# EAGLE design SchematicStepperV3 (EAGLE 7.7.0)
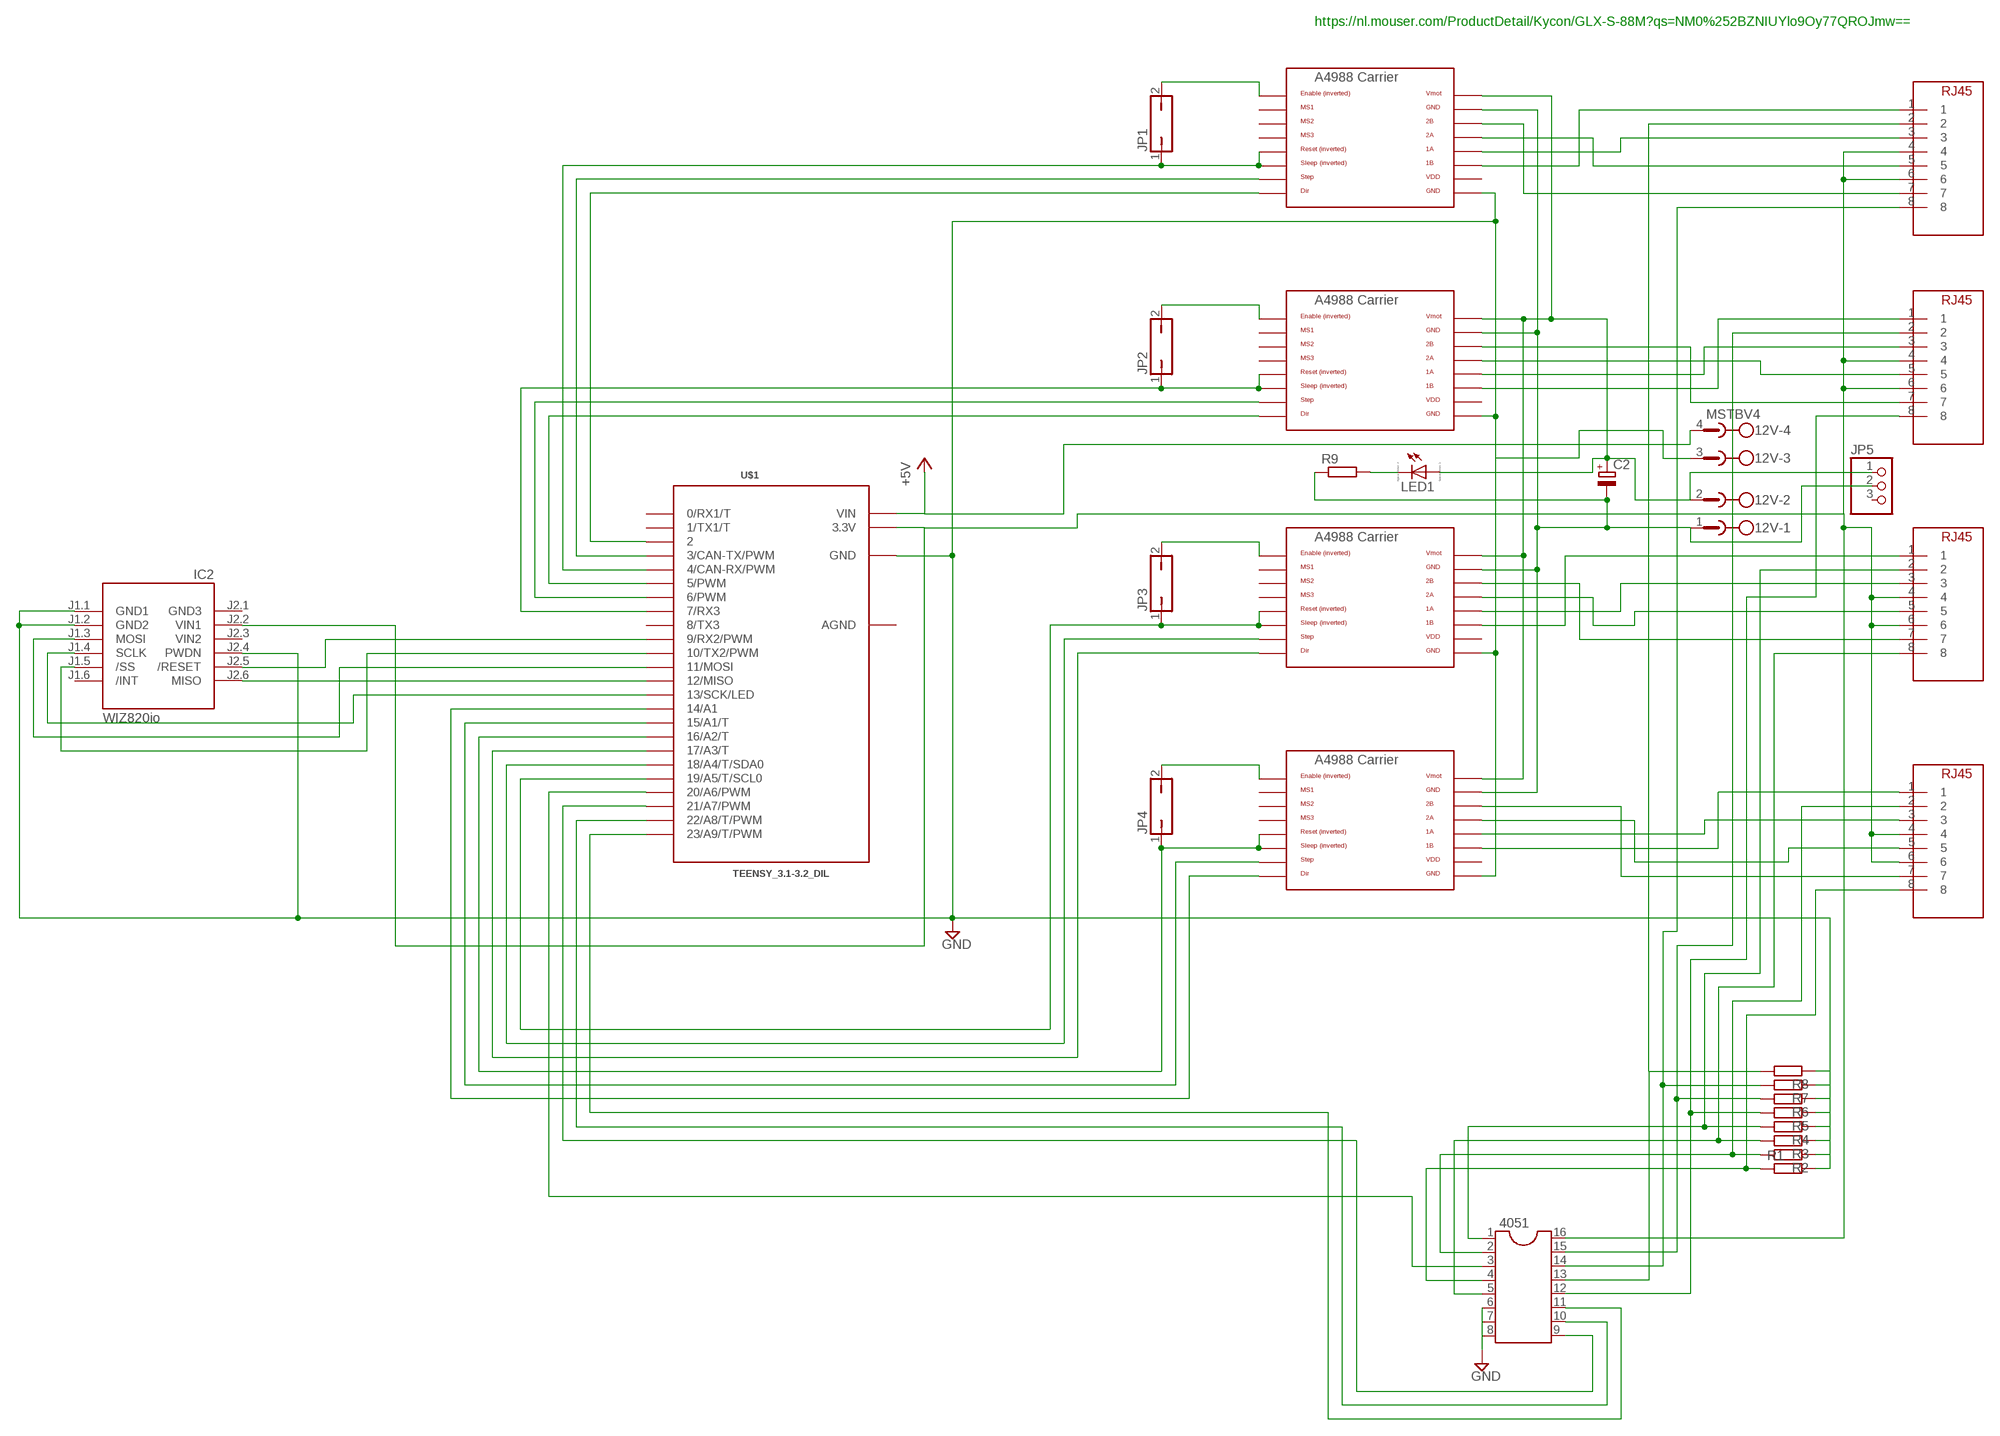
[diagram p0: schematic, sheet 1]

## Parts
12V  MSTBV4  [MSTBV4]
4051  DIL16  [DIL16]
C2  CPOL-EUB45181B  [B45181B]
IC2  WIZ820io  WIZ820IO_DEVICE'DUAL-IN-LINE'  [WIZ820IO]
JP1  JP1Q  [JP1]
JP2  JP1Q  [JP1]
JP3  JP1Q  [JP1]
JP4  JP1Q  [JP1]
JP5  PINHD-1X3  [1X03]
LED1  LED_ELD260  [LED_LD260]
R1  R-EU_0309/10  [0309/10]
R2  R-EU_0309/10  [0309/10]
R3  R-EU_0309/10  [0309/10]
R4  R-EU_0309/10  [0309/10]
R5  R-EU_0309/10  [0309/10]
R6  R-EU_0309/10  [0309/10]
R7  R-EU_0309/10  [0309/10]
R8  R-EU_0309/10  [0309/10]
R9  R-EU_0309/10  [0309/10]
U$1  TEENSY_3.1-3.2_DIL  [TEENSY_3.0-3.2&LC_DIL]
U$2  A4988BREAKOUT  [A4988BREAKOUT]
U$3  A4988BREAKOUT  [A4988BREAKOUT]
U$4  A4988BREAKOUT  [A4988BREAKOUT]
U$5  A4988BREAKOUT  [A4988BREAKOUT]
WEIDMUELLER_RJ1  WEIDMUELLER_RJ45  [WEIDMUELLER_RJ45]
WEIDMUELLER_RJ2  WEIDMUELLER_RJ45  [WEIDMUELLER_RJ45]
WEIDMUELLER_RJ3  WEIDMUELLER_RJ45  [WEIDMUELLER_RJ45]
WEIDMUELLER_RJ4  WEIDMUELLER_RJ45  [WEIDMUELLER_RJ45]

## Nets
4051: 4051.3 U$1.20/A6(20/A6/PWM)
+5V: 12V.4 U$1.VIN
GND: 12V.3 4051.6 4051.7 4051.8 IC2.J1.1(GND1) IC2.J1.2(GND2) IC2.J2.4(PWDN) R1.2 R2.1 R3.1 R4.1 R5.1 R6.1 R7.1 R8.1 U$1.GND U$2.GND U$3.GND U$4.GND U$5.GND
N$1: JP2.1 U$1.7(7/RX3) U$3.RST U$3.SLP(SLEEP)
N$2: 12V.1 C2.- JP5.2 R9.1 U$2.GND_MOT U$3.GND_MOT U$4.GND_MOT U$5.GND_MOT
N$3: JP3.1 U$1.19/A5(19/A5/T/SCL0) U$4.RST U$4.SLP(SLEEP)
N$4: JP1.1 U$1.4(4/CAN-RX/PWM) U$2.RST U$2.SLP(SLEEP)
N$5: U$1.2 U$2.DIR
N$6: U$1.3(3/CAN-TX/PWM) U$2.STEP
N$7: U$1.5(5/PWM) U$3.DIR
N$8: U$1.6(6/PWM) U$3.STEP
N$11: U$1.17/A3(17/A3/T) U$4.DIR
N$12: U$1.18/A4(18/A4/T/SDA0) U$4.STEP
N$13: 12V.2 C2.+ JP5.1 LED1.A U$2.VMOT U$3.VMOT U$4.VMOT U$5.VMOT
N$14: JP4.1 U$1.16/A2(16/A2/T) U$5.RST U$5.SLP(SLEEP)
N$15: U$3.1A WEIDMUELLER_RJ2.3
N$16: U$2.2B WEIDMUELLER_RJ1.7
N$17: U$2.1A WEIDMUELLER_RJ1.3
N$18: 4051.16 IC2.J2.2(VIN1) U$1.3.3V WEIDMUELLER_RJ1.4 WEIDMUELLER_RJ1.6 WEIDMUELLER_RJ2.4 WEIDMUELLER_RJ2.6 WEIDMUELLER_RJ3.4 WEIDMUELLER_RJ3.6 WEIDMUELLER_RJ4.4 WEIDMUELLER_RJ4.6
N$19: IC2.J2.5(/RESET) U$1.9(9/RX2/PWM)
N$20: IC2.J2.6(MISO) U$1.12(12/MISO)
N$21: IC2.J1.3(MOSI) U$1.11(11/MOSI)
N$22: IC2.J1.4(SCLK) U$1.13(13/SCK/LED)
N$23: IC2.J1.5(/SS) U$1.10(10/TX2/PWM)
N$24: U$2.2A WEIDMUELLER_RJ1.5
N$25: U$3.2A WEIDMUELLER_RJ2.5
N$26: U$3.2B WEIDMUELLER_RJ2.7
N$27: U$4.2A WEIDMUELLER_RJ3.5
N$28: U$3.1B WEIDMUELLER_RJ2.1
N$29: U$4.1A WEIDMUELLER_RJ3.3
N$30: U$4.2B WEIDMUELLER_RJ3.7
N$31: U$5.1A WEIDMUELLER_RJ4.3
N$32: U$4.1B WEIDMUELLER_RJ3.1
N$33: U$5.2B WEIDMUELLER_RJ4.7
N$34: U$5.2A WEIDMUELLER_RJ4.5
N$35: U$5.1B WEIDMUELLER_RJ4.1
N$36: LED1.K(C) R9.2
N$37: JP1.2 U$2.EN
N$38: JP2.2 U$3.EN
N$39: JP3.2 U$4.EN
N$40: JP4.2 U$5.EN
N$41: 4051.9 U$1.21/A7(21/A7/PWM)
N$42: 4051.13 R8.2 WEIDMUELLER_RJ1.2
N$43: 4051.10 U$1.22/A8(22/A8/T/PWM)
N$44: 4051.11 U$1.23/A9(23/A9/T/PWM)
N$45: 4051.14 R7.2 WEIDMUELLER_RJ1.8
N$46: 4051.15 R6.2 WEIDMUELLER_RJ2.2
N$47: 4051.12 R5.2 WEIDMUELLER_RJ2.8
N$48: 4051.1 R4.2 WEIDMUELLER_RJ3.2
N$49: 4051.5 R3.2 WEIDMUELLER_RJ3.8
N$50: 4051.2 R2.2 WEIDMUELLER_RJ4.2
N$51: 4051.4 R1.1 WEIDMUELLER_RJ4.8
N$52: U$2.1B WEIDMUELLER_RJ1.1
N$56: U$1.15/A1(15/A1/T) U$5.STEP
N$57: U$1.14/A0(14/A1) U$5.DIR
Unconnected: IC2.J1.6(/INT) JP5.3 U$1.0(0/RX1/T) U$1.1(1/TX1/T) U$1.8(8/TX3) U$2.MS1 U$2.MS2 U$2.MS3 U$3.MS1 U$3.MS2 U$3.MS3 U$4.MS1 U$4.MS2 U$4.MS3 U$5.MS1 U$5.MS2 U$5.MS3

## Notes on the sheet
- https://nl.mouser.com/ProductDetail/Kycon/GLX-S-88M?qs=NM0%252BZNIUYlo9Oy77QROJmw==

## Power pins joined to a net without a drawn wire
AGND: U$1.AGND
GND3: IC2.J2.1(GND3)
VDD: U$2.VDD U$3.VDD U$4.VDD U$5.VDD
VIN2: IC2.J2.3(VIN2)

## Library data of the parts
12V = con-phoenix-508:MSTBV4: PHOENIX; MPN: MSTBV 2,5/4-GF-5.08; OC_FARNELL: 1792794; OC_NEWARK: 69R9847
4051 = ic-package:DIL16: Dual In Line / Socket
C2 = rcl:CPOL-EU: POLARIZED CAPACITOR, European symbol
IC2 = Wiz820io:WIZ820IO_DEVICE: WIZnet, WIZ820io plug in module incl. W5200 chip and MagJack
JP1-JP4 = jumper:JP1Q: JUMPER
JP5 = adafruit:PINHD-1X3: PIN HEADER
LED1 = eagle-ltspice:LED_E: LED Source: http://www.osram.convergy.de Source: www.luxeon.com Source: www.kingbright.com; SPICEMODEL: NONE; SPICEPREFIX: D; SPICETYPE: diode
R1-R9 = rcl:R-EU_: RESISTOR, European symbol
U$1 = Teensy_3_and_LC_Series_Boards_v1.4:TEENSY_3.1-3.2_DIL: Teensy 3.1 or 3.2 in a DIL Layout.
U$2-U$5 = RepRapjr:A4988BREAKOUT
WEIDMUELLER_RJ1-WEIDMUELLER_RJ4 = Weidmueller_RJ45_CAT6 T1U 2.7N4N:WEIDMUELLER_RJ45

## Board
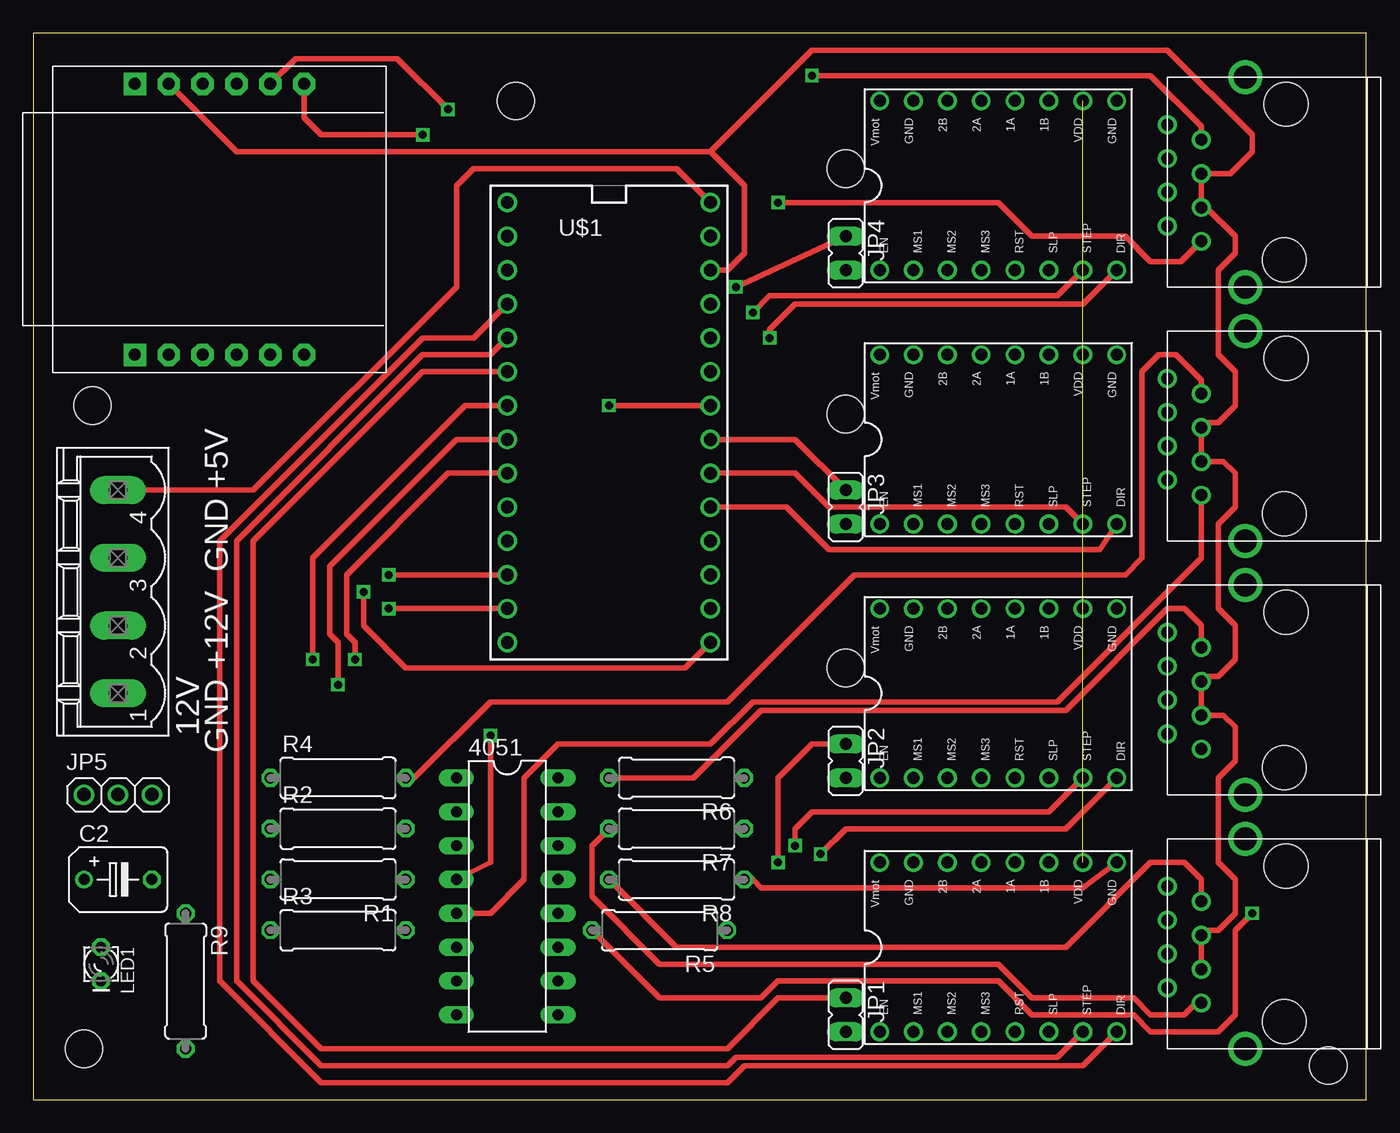
[diagram p1: board, top side]
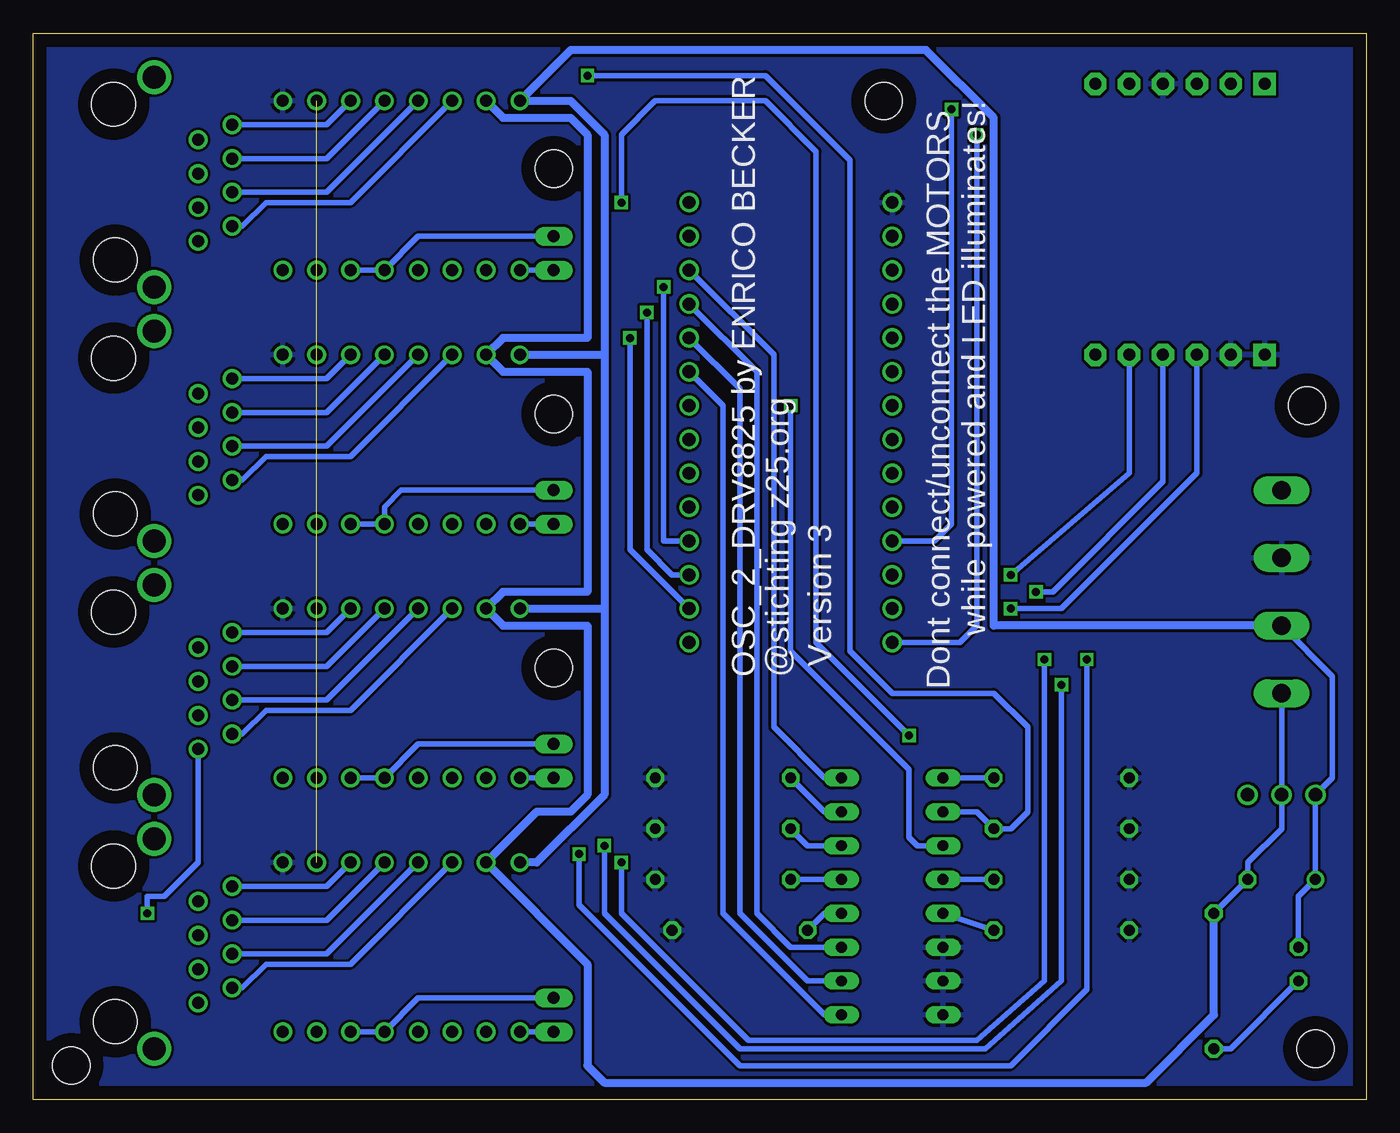
[diagram p2: board, bottom side, seen from below]

Size 100 x 80 mm. Coordinates in mm from the lower left corner, seen from the top.
Outline: 0,0 100,0 100,80 0,80 0,0
Copper layers (1*16): Top 0.035mm / dielectric 1.5mm / Bottom 0.035mm
Design rules "default": minimum track width 10mil, minimum drill 24mil, track to track 8mil, track to pad 8mil, pad to pad 8mil, via to via 8mil, smd to smd 8mil, copper to edge 40mil, drill to drill 8mil, minimum pad ring 10mil, minimum via ring 8mil, stop-mask expansion 4mil, vias tented up to drill 0mil, thermal gap 10mil
Holes 2.8 mm at 3.81,3.81 36.2,74.93 4.45,52.07 97.16,2.54 60.96,32.38 60.96,51.44 60.96,69.85

### Footprints (pad centres in the part's own frame; a part is rotated, then mirrored left to right if it is on the bottom)
MSTBV4 = drill 1.397 long: 1 -7.62,0; 2 -2.54,0; 3 2.54,0; 4 7.62,0
DIL16 = drill 0.813 long: 1 -8.89,-3.81; 2 -6.35,-3.81; 3 -3.81,-3.81; 4 -1.27,-3.81; 5 1.27,-3.81; 6 3.81,-3.81; 7 6.35,-3.81; 8 8.89,-3.81; 9 8.89,3.81; 10 6.35,3.81; 11 3.81,3.81; 12 1.27,3.81; 13 -1.27,3.81; 14 -3.81,3.81; 15 -6.35,3.81; 16 -8.89,3.81
B45181B = drill 0.813: + -2.54,0 | drill 0.813 octagon: - 2.54,0
WIZ820IO = drill 0.9 pad 1.676 square: J1.1 -10.16,6.35; J2.1 10.16,6.35 | drill 0.9 pad 1.676 octagon: J1.2 -10.16,3.81; J1.3 -10.16,1.27; J1.4 -10.16,-1.27; J1.5 -10.16,-3.81; J1.6 -10.16,-6.35; J2.2 10.16,3.81; J2.3 10.16,1.27; J2.4 10.16,-1.27; J2.5 10.16,-3.81; J2.6 10.16,-6.35
JP1 = drill 0.914 long: 1 0,-1.27; 2 0,1.27
1X03 = drill 1.016: 1 -2.54,0; 2 0,0; 3 2.54,0
LED_LD260 = drill 0.813 octagon: A -1.27,0; K 1.27,0
0309/10 = drill 0.813 octagon: 1 -5.08,0; 2 5.08,0
TEENSY_3.0-3.2&LC_DIL = drill 0.965: 0 -7.62,13.97; 1 -7.62,11.43; 2 -7.62,8.89; 3 -7.62,6.35; 3.3V 7.62,11.43; 4 -7.62,3.81; 5 -7.62,1.27; 6 -7.62,-1.27; 7 -7.62,-3.81; 8 -7.62,-6.35; 9 -7.62,-8.89; 10 -7.62,-11.43; 11 -7.62,-13.97; 12 -7.62,-16.51; 13 7.62,-16.51; 14/A0 7.62,-13.97; 15/A1 7.62,-11.43; 16/A2 7.62,-8.89; 17/A3 7.62,-6.35; 18/A4 7.62,-3.81; 19/A5 7.62,-1.27; 20/A6 7.62,1.27; 21/A7 7.62,3.81; 22/A8 7.62,6.35; 23/A9 7.62,8.89; AGND 7.62,13.97; GND -7.62,16.51; VIN 7.62,16.51
A4988BREAKOUT = drill 0.9: 1A 8.89,1.27; 1B 11.43,1.27; 2A 6.35,1.27; 2B 3.81,1.27; DIR 16.51,-11.43; EN -1.27,-11.43; GND 16.51,1.27; GND_MOT 1.27,1.27; MS1 1.27,-11.43; MS2 3.81,-11.43; MS3 6.35,-11.43; RST 8.89,-11.43; SLP 11.43,-11.43; STEP 13.97,-11.43; VDD 13.97,1.27; VMOT -1.27,1.27
WEIDMUELLER_RJ45 = drill 0.9 pad 1.27: 1 12.192,0; 2 11.049,-2.54; 3 9.652,0; 4 8.509,-2.54; 5 7.112,0; 6 5.969,-2.54; 7 4.572,0; 8 3.429,-2.54 | drill 1.702 pad 2.184: P$9 0,-5.842; P$10 15.748,-5.842 | hole 3.302: 2.032,-8.763; 13.716,-8.89

### Placement (x,y rotation side)
12V  6.35,38.1 90 top
4051  35.56,15.24 270 top
C2  6.35,16.51 0 top
IC2  13.97,66.04 90 top
JP1  60.96,6.35 180 top
JP2  60.96,25.4 180 top
JP3  60.96,44.45 180 top
JP4  60.96,63.5 180 top
JP5  6.35,22.86 0 top
LED1  5.08,10.16 270 top
R1  22.86,16.51 180 top
R2  22.86,20.32 0 top
R3  22.86,12.7 0 top
R4  22.86,24.13 0 top
R5  46.99,12.7 180 top
R6  48.26,24.13 180 top
R7  48.26,20.32 180 top
R8  48.26,16.51 180 top
R9  11.43,8.89 270 top
U$1  43.18,50.8 0 top
U$2  64.77,16.51 0 top
U$3  64.77,35.56 0 top
U$4  64.77,54.61 0 top
U$5  64.77,73.66 0 top
WEIDMUELLER_RJ1  85.09,3.81 90 top
WEIDMUELLER_RJ2  85.09,22.86 90 top
WEIDMUELLER_RJ3  85.09,41.91 90 top
WEIDMUELLER_RJ4  85.09,60.96 90 top

### Tracks (layer width: path | path; a pad name or v marks a point on that pad's centre or on a via)
4051  (via drill 0.6)
  Top 0.406: v43.18,52.07 U$1.20/A6
  Bottom 0.406: 4051.3 33.66,19.05 34.29,19.68 34.29,24.77 43.18,33.66 v43.18,52.07
+5V
  Top 0.406: 12V.4 16.51,45.72 31.75,60.96 31.75,68.58 33.02,69.85 48.26,69.85 U$1.VIN
GND
  Top 0.406: U$2.GND 78.74,15.88 54.61,15.88 53.98,16.51 R8.1
  pour Bottom: 0,80.01 100.33,80.01 100.33,0 0,0
N$1  (via drill 0.6)
  Top 0.406: JP2.1 58.42,26.67 55.88,24.13 v55.88,17.78 | v24.13,33.02 24.13,34.29 23.5,34.92 23.5,39.37 31.11,46.99 U$1.7
  Bottom 0.406: U$3.SLP U$3.RST 71.12,26.67 JP2.1 | v55.88,17.78 55.88,13.97 46.35,4.45 29.21,4.45 24.13,8.89 v24.13,33.02
N$2
  Bottom 0.406: R9.1 C2.- 8.89,17.78 6.35,20.32 JP5.2 12V.1
  Bottom 0.61: R9.1 11.43,6.35 16.51,1.27 57.15,1.27 58.42,2.54 58.42,10.16 U$2.GND_MOT 62.23,21.59 59.69,21.59 58.42,22.86 58.42,35.56 64.77,35.56 U$3.GND_MOT 64.77,38.1 58.42,38.1 58.42,54.61 64.77,54.61 U$4.GND_MOT 64.77,57.15 58.42,57.15 58.42,72.39 59.69,73.66 64.77,73.66 U$5.GND_MOT
N$3
  Top 0.406: U$1.19/A5 57.15,49.53 JP3.1
  Bottom 0.406: U$4.SLP U$4.RST 73.66,44.45 72.39,45.72 JP3.1
N$4
  Top 0.406: JP1.1 55.88,7.62 52.07,3.81 21.59,3.81 16.51,8.89 16.51,41.91 29.21,54.61 U$1.4
  Bottom 0.406: U$2.SLP U$2.RST 71.12,7.62 JP1.1
N$5
  Top 0.406: U$2.DIR 78.74,2.54 53.34,2.54 52.07,1.27 21.59,1.27 13.97,8.89 13.97,41.91 29.21,57.15 33.02,57.15 U$1.2
N$6
  Top 0.406: U$2.STEP 76.83,3.17 52.7,3.17 52.07,2.54 21.59,2.54 15.24,8.89 15.24,41.91 29.21,55.88 34.29,55.88 U$1.3
N$7  (via drill 0.6)
  Top 0.406: U$3.DIR 77.47,20.32 60.96,20.32 v59.05,18.41 | v20.95,33.02 20.95,40.64 32.38,52.07 U$1.5
  Bottom 0.406: v59.05,18.41 59.05,14.61 46.99,2.54 26.67,2.54 20.95,8.26 v20.95,33.02
N$8  (via drill 0.6)
  Top 0.406: U$3.STEP 76.2,21.59 58.42,21.59 57.15,20.32 v57.15,19.05 | v22.86,31.11 22.86,34.29 22.23,34.92 22.23,40.01 31.75,49.53 U$1.6
  Bottom 0.406: v57.15,19.05 57.15,13.97 46.99,3.81 28.57,3.81 22.86,8.89 v22.86,31.11
N$11
  Top 0.406: U$1.17/A3 56.52,44.45 59.69,41.27 80.01,41.27 U$4.DIR
N$12
  Top 0.406: U$1.18/A4 57.15,46.99 59.69,44.45 77.47,44.45 U$4.STEP
N$13
  Bottom 0.406: LED1.A 5.08,15.24 C2.+ JP5.1 2.54,24.13 2.54,31.75 12V.2
  Bottom 0.61: 12V.2 27.94,35.56 27.94,73.66 33.02,78.74 59.69,78.74 U$5.VMOT 59.69,74.93 57.15,72.39 57.15,55.88 | 57.15,55.88 57.15,36.83 | 57.15,36.83 57.15,22.86 62.23,17.78 U$2.VMOT | U$3.VMOT 57.15,36.83 | U$4.VMOT 57.15,55.88
N$14  (via drill 0.6)
  Top 0.406: JP4.1 v52.7,60.96
  Bottom 0.406: U$5.SLP U$5.RST 71.12,64.77 JP4.1 | v52.7,60.96 52.7,41.91 U$1.16/A2
N$15
  Bottom 0.406: WEIDMUELLER_RJ2.3 77.98,32.51 U$3.1A
N$16
  Bottom 0.406: WEIDMUELLER_RJ1.7 84.33,8.38 82.55,10.16 76.2,10.16 U$2.2B
N$17
  Bottom 0.406: WEIDMUELLER_RJ1.3 77.98,13.46 U$2.1A
N$18
  Top 0.406: U$1.3.3V 52.07,62.23 53.34,63.5 53.34,68.58 50.8,71.12 | 50.8,71.12 15.24,71.12 IC2.J2.2 | 50.8,71.12 58.42,78.74 85.09,78.74 91.44,72.39 91.44,71.12 89.79,69.47 WEIDMUELLER_RJ4.4 WEIDMUELLER_RJ4.6 88.01,66.93 90.17,64.77 90.17,63.5 88.9,62.23 88.9,55.88 90.17,54.61 90.17,52.07 88.9,50.8 88.01,50.8 WEIDMUELLER_RJ3.4 WEIDMUELLER_RJ3.6 89.28,47.88 90.17,46.99 90.17,44.45 88.9,43.18 88.9,36.83 90.17,35.56 90.17,33.02 88.9,31.75 88.01,31.75 WEIDMUELLER_RJ2.4 WEIDMUELLER_RJ2.6 89.28,28.83 90.17,27.94 90.17,25.4 88.9,24.13 88.9,17.78 90.17,16.51 90.17,13.97 88.9,12.7 88.01,12.7 WEIDMUELLER_RJ1.4 WEIDMUELLER_RJ1.6
  Bottom 0.406: 4051.16 40.64,24.13 44.45,27.94 44.45,55.88 U$1.3.3V
N$19  (via drill 0.6)
  Top 0.406: IC2.J2.5 19.68,78.11 27.3,78.11 v31.11,74.3
  Bottom 0.406: v31.11,74.3 31.11,43.18 32.38,41.91 U$1.9
N$20  (via drill 0.6)
  Top 0.406: IC2.J2.6 20.32,73.66 21.59,72.39 v29.21,72.39
  Bottom 0.406: v29.21,72.39 29.21,35.56 30.48,34.29 U$1.12
N$21  (via drill 0.6)
  Top 0.406: v26.67,36.83 U$1.11
  Bottom 0.406: IC2.J1.3 12.7,46.99 22.86,36.83 v26.67,36.83
N$22  (via drill 0.6)
  Top 0.406: v24.77,38.1 24.77,35.56 27.94,32.38 48.9,32.38 U$1.13
  Bottom 0.406: IC2.J1.4 15.24,46.35 23.5,38.1 v24.77,38.1
N$23  (via drill 0.6)
  Top 0.406: v26.67,39.37 U$1.10
  Bottom 0.406: IC2.J1.5 17.78,46.99 v26.67,39.37
N$24
  Bottom 0.406: WEIDMUELLER_RJ1.5 77.98,10.92 U$2.2A
N$25
  Bottom 0.406: WEIDMUELLER_RJ2.5 77.98,29.97 U$3.2A
N$26
  Bottom 0.406: WEIDMUELLER_RJ2.7 84.33,27.43 82.55,29.21 76.2,29.21 U$3.2B
N$27
  Bottom 0.406: WEIDMUELLER_RJ3.5 77.98,49.02 U$4.2A
N$28
  Bottom 0.406: WEIDMUELLER_RJ2.1 77.98,35.05 U$3.1B
N$29
  Bottom 0.406: WEIDMUELLER_RJ3.3 77.98,51.56 U$4.1A
N$30
  Bottom 0.406: WEIDMUELLER_RJ3.7 84.33,46.48 82.55,48.26 76.2,48.26 U$4.2B
N$31
  Bottom 0.406: WEIDMUELLER_RJ4.3 77.98,70.61 U$5.1A
N$32
  Bottom 0.406: WEIDMUELLER_RJ3.1 77.98,54.1 U$4.1B
N$33
  Bottom 0.406: WEIDMUELLER_RJ4.7 84.33,65.53 82.55,67.31 76.2,67.31 U$5.2B
N$34
  Bottom 0.406: WEIDMUELLER_RJ4.5 77.98,68.07 U$5.2A
N$35
  Bottom 0.406: WEIDMUELLER_RJ4.1 77.98,73.15 U$5.1B
N$36
  Bottom 0.406: R9.2 10.16,3.81 LED1.K
N$37
  Bottom 0.406: JP1.2 U$2.EN
N$38
  Bottom 0.406: JP2.2 U$3.EN
N$39
  Bottom 0.406: JP3.2 U$4.EN
N$40
  Bottom 0.406: JP4.2 U$5.EN
N$41
  Bottom 0.406: 4051.9 40.64,6.35 48.26,13.97 48.26,52.07 U$1.21/A7
N$42
  Top 0.406: R8.2 48.26,11.43 77.47,11.43 83.82,17.78 86.36,17.78 87.63,16.51 WEIDMUELLER_RJ1.2
  Bottom 0.406: 4051.13 R8.2
N$43
  Bottom 0.406: 4051.10 41.91,8.89 46.99,13.97 46.99,53.34 U$1.22/A8
N$44
  Bottom 0.406: 4051.11 43.18,11.43 45.72,13.97 45.72,54.61 U$1.23/A9
N$45
  Top 0.406: WEIDMUELLER_RJ1.8 87.25,7.24 86.36,6.35 83.82,6.35 82.55,7.62 74.93,7.62 72.39,10.16 46.99,10.16 41.91,15.24 41.91,19.05 R7.2
  Bottom 0.406: 4051.14 41.91,19.05 R7.2
N$46
  Top 0.406: WEIDMUELLER_RJ2.2 87.63,35.56 86.36,36.83 85.09,36.83 77.47,29.21 54.61,29.21 49.53,24.13 R6.2
  Bottom 0.406: 4051.15 40.64,21.59 R6.2
N$47  (via drill 0.6)
  Top 0.406: R5.2 46.99,7.62 54.61,7.62 55.88,8.89 72.39,8.89 74.93,6.35 82.55,6.35 83.82,5.08 88.9,5.08 90.17,6.35 90.17,12.7 v91.44,13.97
  Bottom 0.406: 4051.12 40.64,13.97 R5.2 | v91.44,13.97 91.44,15.24 90.17,15.24 87.63,17.78 WEIDMUELLER_RJ2.8
N$48
  Top 0.406: WEIDMUELLER_RJ3.2 87.63,53.98 85.72,55.88 84.45,55.88 83.19,54.61 83.19,40.64 81.92,39.37 61.59,39.37 52.07,29.84 34.29,29.84 28.57,24.13 R4.2
  Bottom 0.406: 4051.1 R4.2
N$49
  Top 0.406: 4051.5 34.29,13.97 36.83,16.51 36.83,24.13 39.37,26.67 50.8,26.67 53.98,29.84 76.83,29.84 87.63,40.64 WEIDMUELLER_RJ3.8
  Bottom 0.406: 4051.5 R3.2
N$50  (via drill 0.6)
  Top 0.406: WEIDMUELLER_RJ4.2 87.63,73.03 83.82,76.83 v58.42,76.83
  Bottom 0.406: 4051.2 29.21,21.59 R2.2 26.67,20.32 25.4,21.59 25.4,27.94 27.94,30.48 35.56,30.48 38.73,33.66 38.73,70.48 45.09,76.83 v58.42,76.83
N$51  (via drill 0.6)
  Top 0.406: 4051.4 34.29,17.78 v34.29,27.3 | v55.88,67.31 72.39,67.31 74.93,64.77 81.92,64.77 83.82,62.87 86.11,62.87 WEIDMUELLER_RJ4.8
  Bottom 0.406: 4051.4 R1.1 | v34.29,27.3 41.27,34.29 41.27,71.12 45.09,74.93 53.34,74.93 55.88,72.39 v55.88,67.31
N$52
  Bottom 0.406: WEIDMUELLER_RJ1.1 77.98,16 U$2.1B
N$56  (via drill 0.6)
  Top 0.406: U$5.STEP 76.83,60.33 55.24,60.33 v53.98,59.05
  Bottom 0.406: v53.98,59.05 53.98,41.27 52.07,39.37 U$1.15/A1
N$57  (via drill 0.6)
  Top 0.406: U$5.DIR 78.74,59.69 57.15,59.69 55.24,57.78 v55.24,57.15
  Bottom 0.406: v55.24,57.15 55.24,41.27 U$1.14/A0
VDD  (3 unrouted)

### Text on the board
tPlace: GND +12V GND +5V
bPlace: OSC_2_DRV8825 by ENRICO BECKER | Dont connect/unconnect the MOTORS / while powered and LED illuminates! | @stichting z25.org | Version 3